# Altium schematic sheet [20]-CONNECT_CONNECTORS.SchDoc
size A4
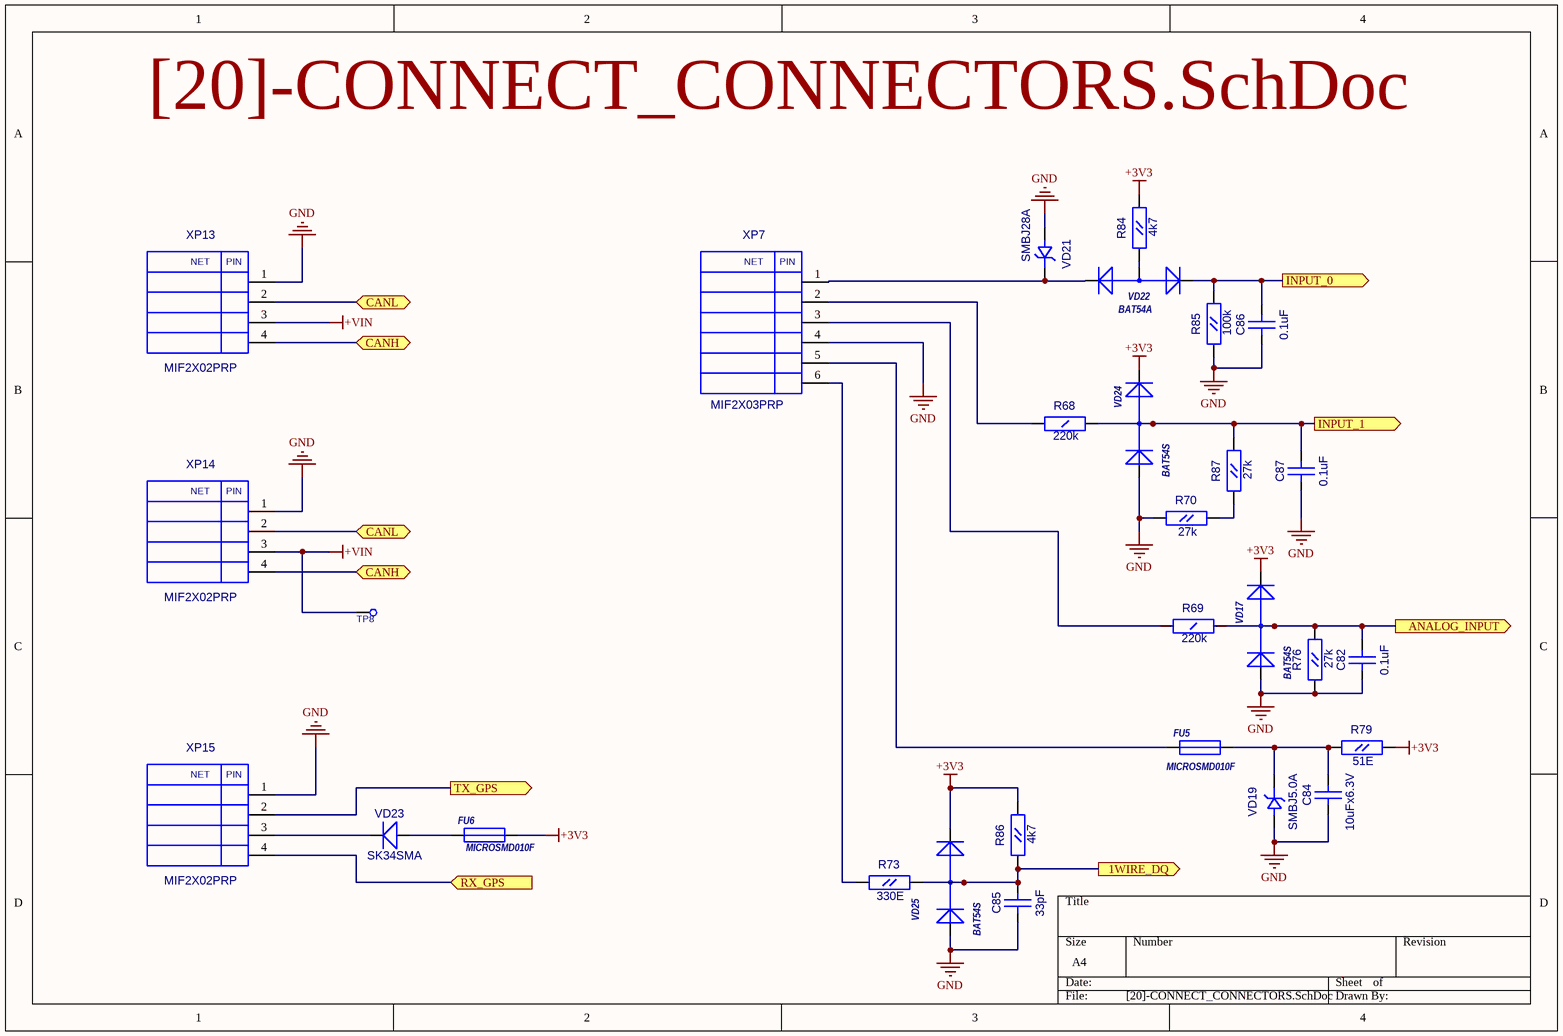
[diagram p0: [20]-CONNECT_CONNECTORS.SchDoc]

## Parts
C82  0.1uF  [CC0603]
C84  10uFx6.3V  [CC0805]
C85  33pF  [CC0603]
C86  0.1uF  [CC0603]
C87  0.1uF  [CC0603]
FU5  MICROSMD010F  [RC1210]
FU6  MICROSMD010F  [RC1210]
R68  220k  [RC1206]
R69  220k  [RC1206]
R70  27k  [RC0603]
R73  330E  [RC0603]
R76  27k  [RC0603]
R79  51E  [RC0603]
R84  4k7  [RC0603]
R85  100k  [RC0603]
R86  4k7  [RC0603]
R87  27k  [RC0603]
TP8  TESTPOINT1  [TESTPOINT1]  (value not drawn)
VD17  BAT54S  [SOT-23(GSD)]
VD19  SMBJ5.0A  [SMB]
VD21  SMBJ28A  [SMB]
VD22  BAT54A  [SOT-23(123)]
VD23  SK34SMA  [SMA]
VD24  BAT54S  [SOT-23(GSD)]
VD25  BAT54S  [SOT-23(GSD)]
XP7  MIF2X03PRP  [MIF2X03PRP]
XP13  MIF2X02PRP  [MIF2X02PRP]
XP14  MIF2X02PRP  [MIF2X02PRP]
XP15  MIF2X02PRP  [MIF2X02PRP]

## Ports
1WIRE_DQ (out), ANALOG_INPUT (out), CANH (bidir), CANL (bidir), INPUT_0 (out), INPUT_1 (out), RX_GPS (in), TX_GPS (out)

## Nets
+3V3: FU6.2 R79.2(B) R84.2(B) R86.2(B) VD17.2(K) VD24.2(K) VD25.2(K)
+VIN: TP8.1 XP13.3 XP14.3
GND: C82.1(A) C84.1(A) C85.1(A) C86.1(A) C87.1(A) R70.1(A) R76.1(A) R85.1(A) VD17.1(A) VD19.1(A) VD21.1(A) VD24.1(A) VD25.1(A) XP7.4 XP13.1 XP14.1 XP15.1
1WIRE_DQ: C85.2(B) R73.2(B) R86.1(A) VD25.3(AK) ; port 1WIRE_DQ
ANALOG_INPUT: C82.2(B) R69.2(B) R76.2(B) VD17.3(AK) ; port ANALOG_INPUT
CANH: XP13.4 XP14.4 ; port CANH
CANL: XP13.2 XP14.2 ; port CANL
INPUT_0: C86.2(B) R85.2(B) VD22.2(K) ; port INPUT_0
INPUT_1: C87.2(B) R68.2(B) R87.2(B) VD24.3(AK) ; port INPUT_1
RX_GPS: XP15.4 ; port RX_GPS
TX_GPS: XP15.2 ; port TX_GPS
NetC84_2: C84.2(B) FU5.2 R79.1(A) VD19.2(K)
NetFU5_1: FU5.1 XP7.5
NetFU6_1: FU6.1 VD23.1(A)
NetR68_1: R68.1(A) XP7.2
NetR69_1: R69.1(A) XP7.3
NetR70_2: R70.2(B) R87.1(A)
NetR73_1: R73.1(A) XP7.6
NetR84_1: R84.1(A) VD22.3(A)
NetVD21_2: VD21.2(K) VD22.1(K) XP7.1
NetVD23_2: VD23.2(K) XP15.3

## Notes on the sheet
- (in symbol MIF2X02PRP) NET; PIN
- (in symbol MIF2X03PRP) NET; PIN

## Library data of the parts
C82 C85-C87 = CC0603
  C82 C86 C87: Value: 0.1uF
  C85: Value: 33pF
C84 = CC0805: Value: 10uFx6.3V
FU5 FU6 = MICROSMD: Value: MICROSMD010F
R68 R69 = RC1206: Value: 220k
R70 R73 R76 R79 R84-R87 = RC0603
  R70 R76 R87: Value: 27k
  R73: Value: 330E
  R79: Value: 51E
  R84 R86: Value: 4k7
  R85: Value: 100k
VD17 VD24 VD25 = BAT54S: 1.0 Ampere General Purpose Rectifier; ComponentField6: Published 8-Jun-2000, Modified 11-July-2000: SIM Model Added.; Value: *
VD19 VD21 = SMBJ
  VD19: Value: SMBJ5.0A
  VD21: Value: SMBJ28A
VD22 = BAT54A: 1.0 Ampere General Purpose Rectifier; ComponentField6: Published 8-Jun-2000, Modified 11-July-2000: SIM Model Added.; Value: *
VD23 = SK34SMA: Schottky Rectifier; Value: {Value}
TP8 = TESTPOINT1: Value: *
XP7 = MIF2X03PRP: Value: *
XP13-XP15 = MIF2X02PRP: Value: *